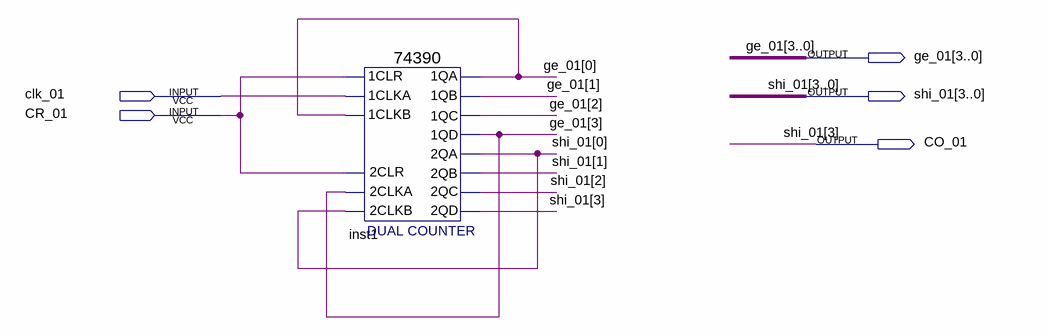
[diagram p0: schematic sheet]
// Quartus schematic cnt100.bdf as structural Verilog: 1 symbols, 5 pins
module cnt100 (
  input  clk_01,
  input  CR_01,
  output [3:0] ge_01,
  output [3:0] shi_01,
  output CO_01
);

  \74390  inst1 (
    .\2CLKA (ge_01[3]), .\2CLR (CR_01), .\2CLKB (shi_01[0]), .\1CLR (CR_01), .\1CLKA (clk_01),
    .\1CLKB (ge_01[0]), .\1QA (ge_01[0]), .\1QB (ge_01[1]), .\1QC (ge_01[2]), .\1QD (ge_01[3]),
    .\2QA (shi_01[0]), .\2QB (shi_01[1]), .\2QC (shi_01[2]), .\2QD (CO_01));

  assign shi_01[3] = CO_01;
endmodule
